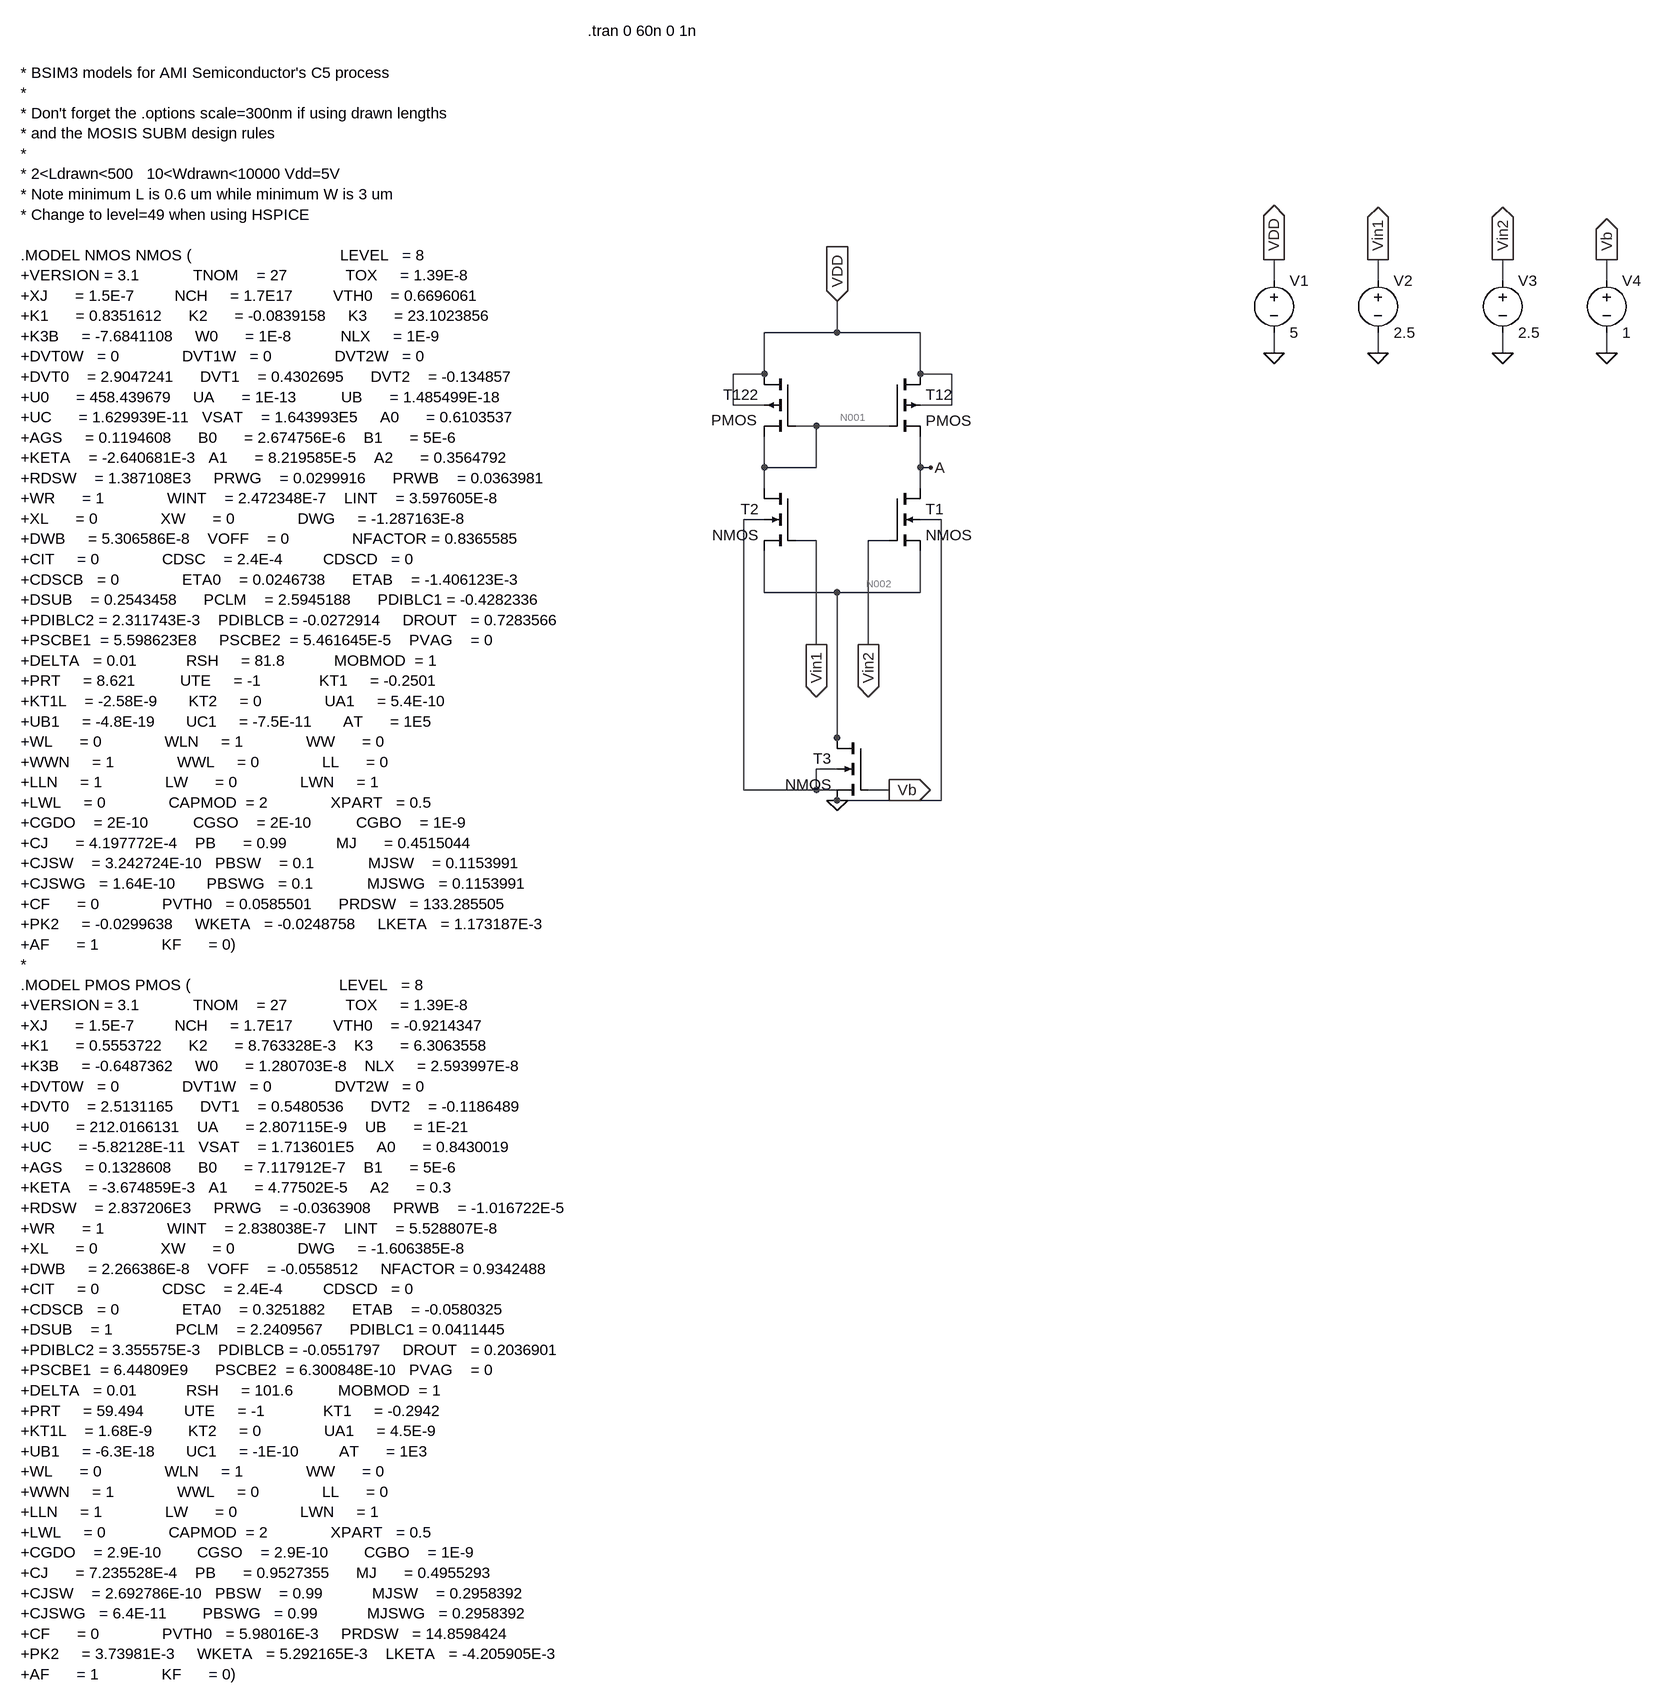
[diagram p0: schematic TPEjemploBasico.asc]
TPEjemploBasico.asc, the LTspice schematic file:
Version 4
SHEET 1 2188 2820
WIRE -560 -480 -560 -512
WIRE -400 -480 -400 -512
WIRE -208 -480 -208 -512
WIRE -48 -480 -48 -512
WIRE -1232 -400 -1232 -448
WIRE -1232 -400 -1344 -400
WIRE -1104 -400 -1232 -400
WIRE -560 -368 -560 -400
WIRE -400 -368 -400 -400
WIRE -208 -368 -208 -400
WIRE -48 -368 -48 -400
WIRE -1344 -336 -1344 -400
WIRE -1344 -336 -1392 -336
WIRE -1104 -336 -1104 -400
WIRE -1056 -336 -1104 -336
WIRE -1392 -288 -1392 -336
WIRE -1344 -288 -1392 -288
WIRE -1056 -288 -1056 -336
WIRE -1056 -288 -1104 -288
WIRE -1264 -256 -1296 -256
WIRE -1152 -256 -1264 -256
WIRE -1344 -192 -1344 -240
WIRE -1264 -192 -1264 -256
WIRE -1264 -192 -1344 -192
WIRE -1104 -192 -1104 -240
WIRE -1088 -192 -1104 -192
WIRE -1344 -160 -1344 -192
WIRE -1104 -160 -1104 -192
WIRE -1344 -112 -1376 -112
WIRE -1072 -112 -1104 -112
WIRE -1264 -80 -1296 -80
WIRE -1152 -80 -1184 -80
WIRE -1344 0 -1344 -64
WIRE -1232 0 -1344 0
WIRE -1104 0 -1104 -64
WIRE -1104 0 -1232 0
WIRE -1264 80 -1264 -80
WIRE -1184 80 -1184 -80
WIRE -1232 224 -1232 0
WIRE -1232 240 -1232 224
WIRE -1232 272 -1264 272
WIRE -1376 304 -1376 -112
WIRE -1264 304 -1264 272
WIRE -1264 304 -1376 304
WIRE -1232 304 -1264 304
WIRE -1152 304 -1184 304
WIRE -1232 320 -1232 304
WIRE -1072 320 -1072 -112
WIRE -1072 320 -1232 320
FLAG -560 -368 0
FLAG -560 -512 VDD
IOPIN -560 -512 Out
FLAG -1232 -448 VDD
IOPIN -1232 -448 In
FLAG -1088 -192 A
FLAG -400 -368 0
FLAG -400 -512 Vin1
IOPIN -400 -512 Out
FLAG -208 -368 0
FLAG -208 -512 Vin2
IOPIN -208 -512 Out
FLAG -1264 80 Vin1
IOPIN -1264 80 Out
FLAG -1184 80 Vin2
IOPIN -1184 80 Out
FLAG -48 -368 0
FLAG -48 -512 Vb
IOPIN -48 -512 Out
FLAG -1152 304 Vb
IOPIN -1152 304 Out
FLAG -1232 320 0
SYMBOL voltage -560 -496 R0
WINDOW 123 0 0 Left 0
WINDOW 39 0 0 Left 0
SYMATTR InstName V1
SYMATTR Value 5
SYMBOL pmos4 -1152 -336 R0
SYMATTR InstName T12
SYMATTR Value2 l=9u w=12u
SYMBOL pmos4 -1296 -336 M0
WINDOW 3 59 71 Left 2
SYMATTR InstName T122
SYMATTR Value2 l=9u w=12u
SYMBOL nmos4 -1296 -160 M0
SYMATTR InstName T2
SYMATTR Value2 l=2u w=12u
SYMBOL nmos4 -1152 -160 R0
SYMATTR InstName T1
SYMATTR Value2 l=2u w=12u
SYMBOL voltage -400 -496 R0
WINDOW 123 0 0 Left 0
WINDOW 39 0 0 Left 0
SYMATTR InstName V2
SYMATTR Value 2.5
SYMBOL voltage -208 -496 R0
WINDOW 123 0 0 Left 0
WINDOW 39 0 0 Left 0
SYMATTR InstName V3
SYMATTR Value 2.5
SYMBOL nmos4 -1184 224 M0
SYMATTR InstName T3
SYMATTR Value2 l=2u w=24u
SYMBOL voltage -48 -496 R0
WINDOW 123 0 0 Left 0
WINDOW 39 0 0 Left 0
SYMATTR InstName V4
SYMATTR Value 1
TEXT -1616 -864 Left 2 !.tran 0 60n 0 1n
TEXT -2488 -800 Left 2 !* BSIM3 models for AMI Semiconductor's C5 process\n*\n* Don't forget the .options scale=300nm if using drawn lengths\n* and the MOSIS SUBM design rules\n*\n* 2<Ldrawn<500   10<Wdrawn<10000 Vdd=5V\n* Note minimum L is 0.6 um while minimum W is 3 um\n* Change to level=49 when using HSPICE\n \n.MODEL NMOS NMOS (                                 LEVEL   = 8\n+VERSION = 3.1            TNOM    = 27             TOX     = 1.39E-8\n+XJ      = 1.5E-7         NCH     = 1.7E17         VTH0    = 0.6696061\n+K1      = 0.8351612      K2      = -0.0839158     K3      = 23.1023856\n+K3B     = -7.6841108     W0      = 1E-8           NLX     = 1E-9\n+DVT0W   = 0              DVT1W   = 0              DVT2W   = 0\n+DVT0    = 2.9047241      DVT1    = 0.4302695      DVT2    = -0.134857\n+U0      = 458.439679     UA      = 1E-13          UB      = 1.485499E-18\n+UC      = 1.629939E-11   VSAT    = 1.643993E5     A0      = 0.6103537\n+AGS     = 0.1194608      B0      = 2.674756E-6    B1      = 5E-6\n+KETA    = -2.640681E-3   A1      = 8.219585E-5    A2      = 0.3564792\n+RDSW    = 1.387108E3     PRWG    = 0.0299916      PRWB    = 0.0363981\n+WR      = 1              WINT    = 2.472348E-7    LINT    = 3.597605E-8\n+XL      = 0              XW      = 0              DWG     = -1.287163E-8\n+DWB     = 5.306586E-8    VOFF    = 0              NFACTOR = 0.8365585\n+CIT     = 0              CDSC    = 2.4E-4         CDSCD   = 0\n+CDSCB   = 0              ETA0    = 0.0246738      ETAB    = -1.406123E-3\n+DSUB    = 0.2543458      PCLM    = 2.5945188      PDIBLC1 = -0.4282336\n+PDIBLC2 = 2.311743E-3    PDIBLCB = -0.0272914     DROUT   = 0.7283566\n+PSCBE1  = 5.598623E8     PSCBE2  = 5.461645E-5    PVAG    = 0\n+DELTA   = 0.01           RSH     = 81.8           MOBMOD  = 1\n+PRT     = 8.621          UTE     = -1             KT1     = -0.2501\n+KT1L    = -2.58E-9       KT2     = 0              UA1     = 5.4E-10\n+UB1     = -4.8E-19       UC1     = -7.5E-11       AT      = 1E5\n+WL      = 0              WLN     = 1              WW      = 0\n+WWN     = 1              WWL     = 0              LL      = 0\n+LLN     = 1              LW      = 0              LWN     = 1\n+LWL     = 0              CAPMOD  = 2              XPART   = 0.5\n+CGDO    = 2E-10          CGSO    = 2E-10          CGBO    = 1E-9\n+CJ      = 4.197772E-4    PB      = 0.99           MJ      = 0.4515044\n+CJSW    = 3.242724E-10   PBSW    = 0.1            MJSW    = 0.1153991\n+CJSWG   = 1.64E-10       PBSWG   = 0.1            MJSWG   = 0.1153991\n+CF      = 0              PVTH0   = 0.0585501      PRDSW   = 133.285505\n+PK2     = -0.0299638     WKETA   = -0.0248758     LKETA   = 1.173187E-3\n+AF      = 1              KF      = 0)\n*\n.MODEL PMOS PMOS (                                 LEVEL   = 8\n+VERSION = 3.1            TNOM    = 27             TOX     = 1.39E-8\n+XJ      = 1.5E-7         NCH     = 1.7E17         VTH0    = -0.9214347\n+K1      = 0.5553722      K2      = 8.763328E-3    K3      = 6.3063558\n+K3B     = -0.6487362     W0      = 1.280703E-8    NLX     = 2.593997E-8\n+DVT0W   = 0              DVT1W   = 0              DVT2W   = 0\n+DVT0    = 2.5131165      DVT1    = 0.5480536      DVT2    = -0.1186489\n+U0      = 212.0166131    UA      = 2.807115E-9    UB      = 1E-21\n+UC      = -5.82128E-11   VSAT    = 1.713601E5     A0      = 0.8430019\n+AGS     = 0.1328608      B0      = 7.117912E-7    B1      = 5E-6\n+KETA    = -3.674859E-3   A1      = 4.77502E-5     A2      = 0.3\n+RDSW    = 2.837206E3     PRWG    = -0.0363908     PRWB    = -1.016722E-5\n+WR      = 1              WINT    = 2.838038E-7    LINT    = 5.528807E-8\n+XL      = 0              XW      = 0              DWG     = -1.606385E-8\n+DWB     = 2.266386E-8    VOFF    = -0.0558512     NFACTOR = 0.9342488\n+CIT     = 0              CDSC    = 2.4E-4         CDSCD   = 0\n+CDSCB   = 0              ETA0    = 0.3251882      ETAB    = -0.0580325\n+DSUB    = 1              PCLM    = 2.2409567      PDIBLC1 = 0.0411445\n+PDIBLC2 = 3.355575E-3    PDIBLCB = -0.0551797     DROUT   = 0.2036901\n+PSCBE1  = 6.44809E9      PSCBE2  = 6.300848E-10   PVAG    = 0\n+DELTA   = 0.01           RSH     = 101.6          MOBMOD  = 1\n+PRT     = 59.494         UTE     = -1             KT1     = -0.2942\n+KT1L    = 1.68E-9        KT2     = 0              UA1     = 4.5E-9\n+UB1     = -6.3E-18       UC1     = -1E-10         AT      = 1E3\n+WL      = 0              WLN     = 1              WW      = 0\n+WWN     = 1              WWL     = 0              LL      = 0\n+LLN     = 1              LW      = 0              LWN     = 1\n+LWL     = 0              CAPMOD  = 2              XPART   = 0.5\n+CGDO    = 2.9E-10        CGSO    = 2.9E-10        CGBO    = 1E-9\n+CJ      = 7.235528E-4    PB      = 0.9527355      MJ      = 0.4955293\n+CJSW    = 2.692786E-10   PBSW    = 0.99           MJSW    = 0.2958392\n+CJSWG   = 6.4E-11        PBSWG   = 0.99           MJSWG   = 0.2958392\n+CF      = 0              PVTH0   = 5.98016E-3     PRDSW   = 14.8598424\n+PK2     = 3.73981E-3     WKETA   = 5.292165E-3    LKETA   = -4.205905E-3 \n+AF      = 1              KF      = 0)

The netlist it stands for:
* TPEjemploBasico.asc
V1 VDD 0 5
M§T12 VDD N001 A VDD PMOS l=9u w=12u
M§T122 VDD N001 N001 VDD PMOS l=9u w=12u
M§T2 N001 Vin1 N002 0 NMOS l=2u w=12u
M§T1 A Vin2 N002 0 NMOS l=2u w=12u
V2 Vin1 0 2.5
V3 Vin2 0 2.5
M§T3 N002 Vb 0 0 NMOS l=2u w=24u
V4 Vb 0 1
.model NMOS NMOS
.model PMOS PMOS
.lib standard.mos
.tran 0 60n 0 1n
* BSIM3 models for AMI Semiconductor's C5 process
*
* Don't forget the .options scale=300nm if using drawn lengths
* and the MOSIS SUBM design rules
*
* 2<Ldrawn<500   10<Wdrawn<10000 Vdd=5V
* Note minimum L is 0.6 um while minimum W is 3 um
* Change to level=49 when using HSPICE
.MODEL NMOS NMOS (                                 LEVEL   = 8
+VERSION = 3.1            TNOM    = 27             TOX     = 1.39E-8
+XJ      = 1.5E-7         NCH     = 1.7E17         VTH0    = 0.6696061
+K1      = 0.8351612      K2      = -0.0839158     K3      = 23.1023856
+K3B     = -7.6841108     W0      = 1E-8           NLX     = 1E-9
+DVT0W   = 0              DVT1W   = 0              DVT2W   = 0
+DVT0    = 2.9047241      DVT1    = 0.4302695      DVT2    = -0.134857
+U0      = 458.439679     UA      = 1E-13          UB      = 1.485499E-18
+UC      = 1.629939E-11   VSAT    = 1.643993E5     A0      = 0.6103537
+AGS     = 0.1194608      B0      = 2.674756E-6    B1      = 5E-6
+KETA    = -2.640681E-3   A1      = 8.219585E-5    A2      = 0.3564792
+RDSW    = 1.387108E3     PRWG    = 0.0299916      PRWB    = 0.0363981
+WR      = 1              WINT    = 2.472348E-7    LINT    = 3.597605E-8
+XL      = 0              XW      = 0              DWG     = -1.287163E-8
+DWB     = 5.306586E-8    VOFF    = 0              NFACTOR = 0.8365585
+CIT     = 0              CDSC    = 2.4E-4         CDSCD   = 0
+CDSCB   = 0              ETA0    = 0.0246738      ETAB    = -1.406123E-3
+DSUB    = 0.2543458      PCLM    = 2.5945188      PDIBLC1 = -0.4282336
+PDIBLC2 = 2.311743E-3    PDIBLCB = -0.0272914     DROUT   = 0.7283566
+PSCBE1  = 5.598623E8     PSCBE2  = 5.461645E-5    PVAG    = 0
+DELTA   = 0.01           RSH     = 81.8           MOBMOD  = 1
+PRT     = 8.621          UTE     = -1             KT1     = -0.2501
+KT1L    = -2.58E-9       KT2     = 0              UA1     = 5.4E-10
+UB1     = -4.8E-19       UC1     = -7.5E-11       AT      = 1E5
+WL      = 0              WLN     = 1              WW      = 0
+WWN     = 1              WWL     = 0              LL      = 0
+LLN     = 1              LW      = 0              LWN     = 1
+LWL     = 0              CAPMOD  = 2              XPART   = 0.5
+CGDO    = 2E-10          CGSO    = 2E-10          CGBO    = 1E-9
+CJ      = 4.197772E-4    PB      = 0.99           MJ      = 0.4515044
+CJSW    = 3.242724E-10   PBSW    = 0.1            MJSW    = 0.1153991
+CJSWG   = 1.64E-10       PBSWG   = 0.1            MJSWG   = 0.1153991
+CF      = 0              PVTH0   = 0.0585501      PRDSW   = 133.285505
+PK2     = -0.0299638     WKETA   = -0.0248758     LKETA   = 1.173187E-3
+AF      = 1              KF      = 0)
*
.MODEL PMOS PMOS (                                 LEVEL   = 8
+VERSION = 3.1            TNOM    = 27             TOX     = 1.39E-8
+XJ      = 1.5E-7         NCH     = 1.7E17         VTH0    = -0.9214347
+K1      = 0.5553722      K2      = 8.763328E-3    K3      = 6.3063558
+K3B     = -0.6487362     W0      = 1.280703E-8    NLX     = 2.593997E-8
+DVT0W   = 0              DVT1W   = 0              DVT2W   = 0
+DVT0    = 2.5131165      DVT1    = 0.5480536      DVT2    = -0.1186489
+U0      = 212.0166131    UA      = 2.807115E-9    UB      = 1E-21
+UC      = -5.82128E-11   VSAT    = 1.713601E5     A0      = 0.8430019
+AGS     = 0.1328608      B0      = 7.117912E-7    B1      = 5E-6
+KETA    = -3.674859E-3   A1      = 4.77502E-5     A2      = 0.3
+RDSW    = 2.837206E3     PRWG    = -0.0363908     PRWB    = -1.016722E-5
+WR      = 1              WINT    = 2.838038E-7    LINT    = 5.528807E-8
+XL      = 0              XW      = 0              DWG     = -1.606385E-8
+DWB     = 2.266386E-8    VOFF    = -0.0558512     NFACTOR = 0.9342488
+CIT     = 0              CDSC    = 2.4E-4         CDSCD   = 0
+CDSCB   = 0              ETA0    = 0.3251882      ETAB    = -0.0580325
+DSUB    = 1              PCLM    = 2.2409567      PDIBLC1 = 0.0411445
+PDIBLC2 = 3.355575E-3    PDIBLCB = -0.0551797     DROUT   = 0.2036901
+PSCBE1  = 6.44809E9      PSCBE2  = 6.300848E-10   PVAG    = 0
+DELTA   = 0.01           RSH     = 101.6          MOBMOD  = 1
+PRT     = 59.494         UTE     = -1             KT1     = -0.2942
+KT1L    = 1.68E-9        KT2     = 0              UA1     = 4.5E-9
+UB1     = -6.3E-18       UC1     = -1E-10         AT      = 1E3
+WL      = 0              WLN     = 1              WW      = 0
+WWN     = 1              WWL     = 0              LL      = 0
+LLN     = 1              LW      = 0              LWN     = 1
+LWL     = 0              CAPMOD  = 2              XPART   = 0.5
+CGDO    = 2.9E-10        CGSO    = 2.9E-10        CGBO    = 1E-9
+CJ      = 7.235528E-4    PB      = 0.9527355      MJ      = 0.4955293
+CJSW    = 2.692786E-10   PBSW    = 0.99           MJSW    = 0.2958392
+CJSWG   = 6.4E-11        PBSWG   = 0.99           MJSWG   = 0.2958392
+CF      = 0              PVTH0   = 5.98016E-3     PRDSW   = 14.8598424
+PK2     = 3.73981E-3     WKETA   = 5.292165E-3    LKETA   = -4.205905E-3
+AF      = 1              KF      = 0)
.backanno
.end

* Results of the author's LTspice run, read from the files saved beside the schematic
* Operating Point, zero values left out:
*   V(vdd) = 5 V
*   V(n001) = 2.801 V
*   V(a) = 2.801 V
*   V(vin1) = 2.5 V
*   V(n002) = 1.175 V
*   V(vin2) = 2.5 V
*   V(vb) = 1 V
*   Id(T3) = 57.44 µA
*   Ib(T3) = -1.185 pA
*   Is(T3) = -57.44 µA
*   Id(T1) = 28.72 µA
*   Ib(T1) = -3.996 pA
*   Is(T1) = -28.72 µA
*   Id(T2) = 28.72 µA
*   Ib(T2) = -3.996 pA
*   Is(T2) = -28.72 µA
*   Id(T122) = 28.72 µA
*   Ib(T122) = 2.209 pA
*   Is(T122) = -28.72 µA
*   Id(T12) = 28.72 µA
*   Ib(T12) = 2.209 pA
*   Is(T12) = -28.72 µA
*   I(V1) = -57.44 µA